# EAGLE design apresentação1 (EAGLE 6.2)
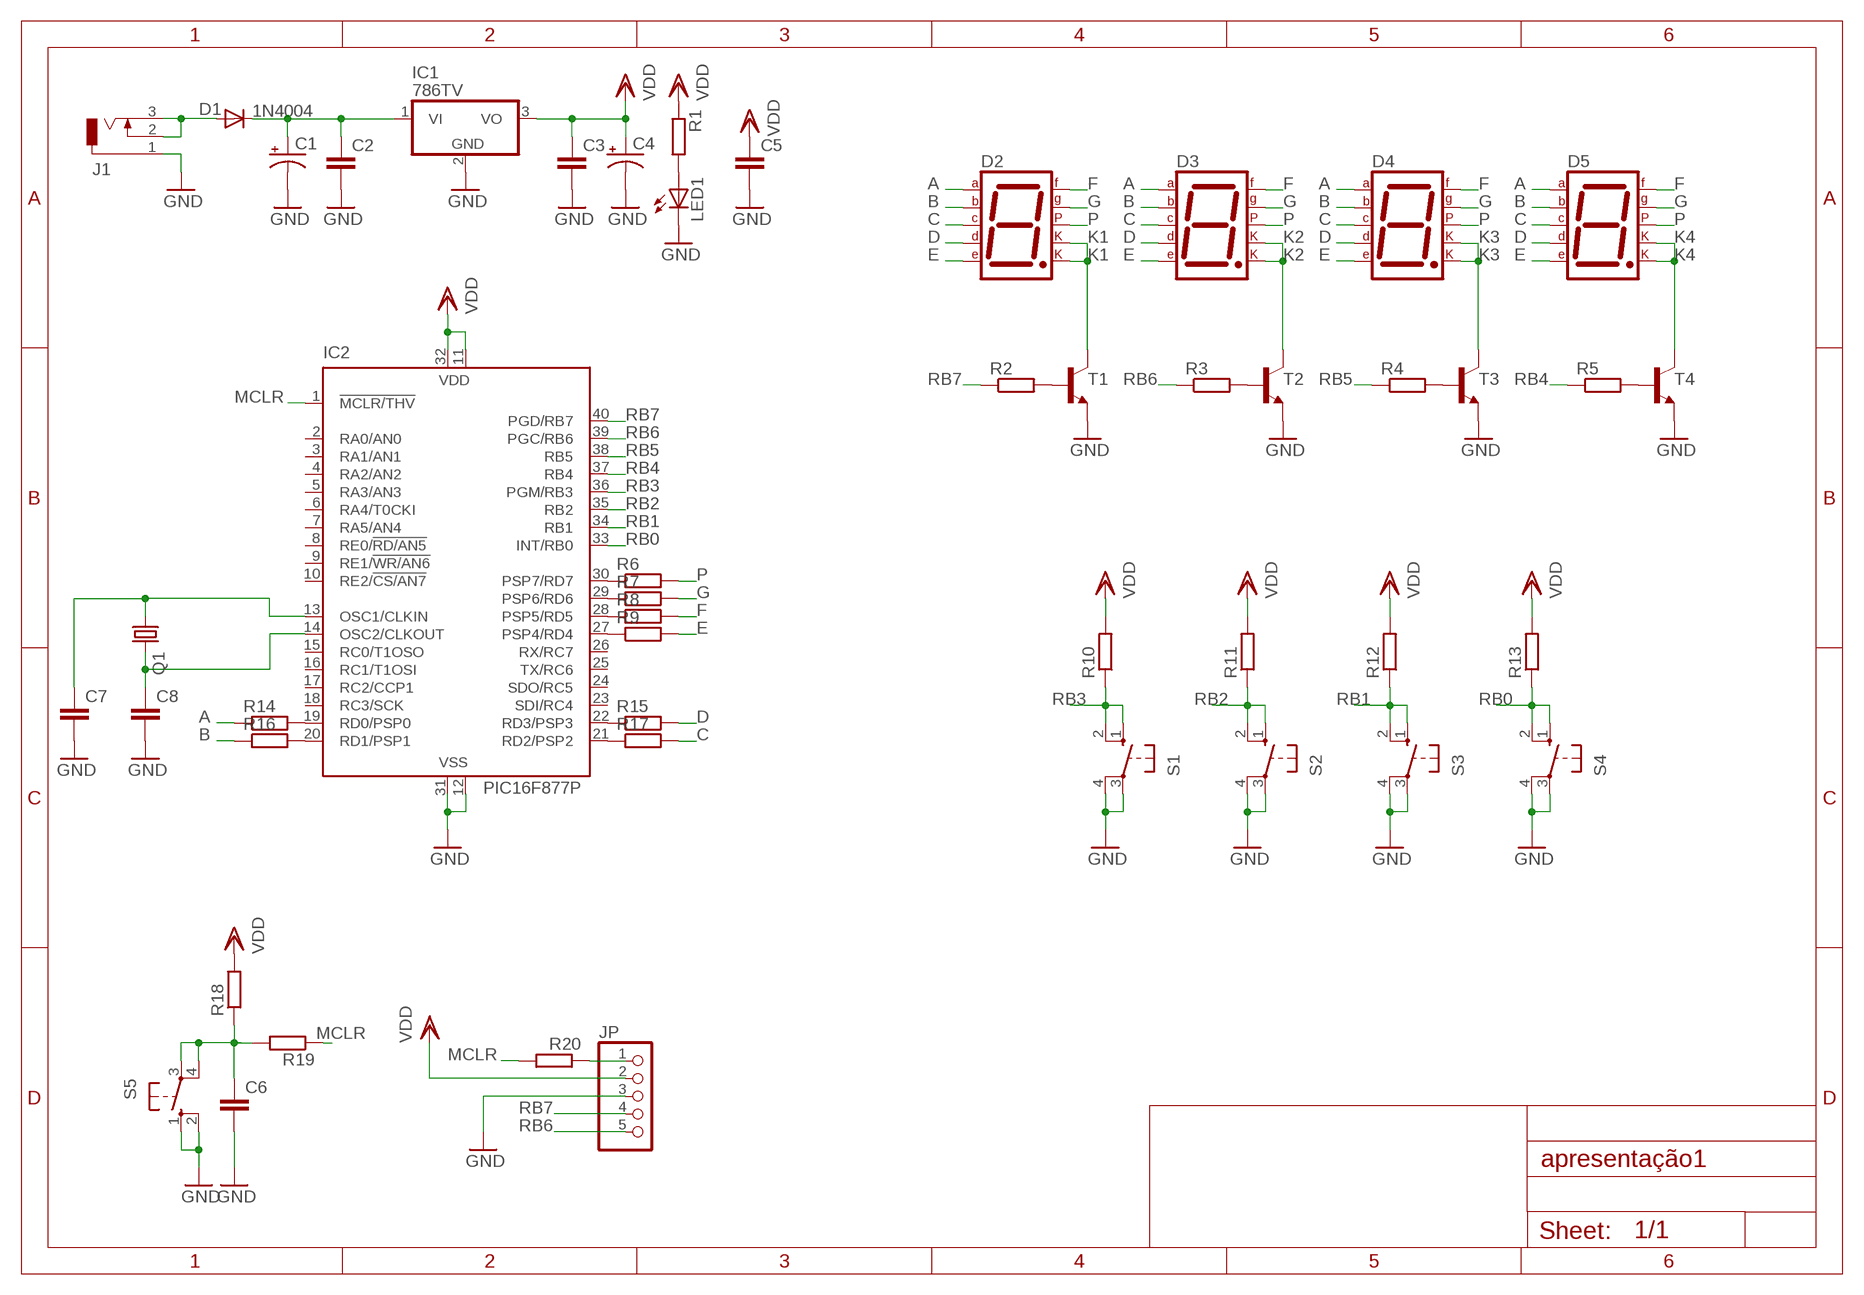
[diagram p0: schematic, sheet 1]

## Parts
C1  CPOL-USE2.5-5  [E2,5-5]
C2  C-EU025-025X050  [C025-025X050]
C3  C-EU025-025X050  [C025-025X050]
C4  CPOL-USE2.5-5  [E2,5-5]
C5  C-EU025-025X050  [C025-025X050]
C6  C-EU025-025X050  [C025-025X050]
C7  C-EU025-025X050  [C025-025X050]
C8  C-EU025-025X050  [C025-025X050]
D1  1N4004  [DO41-10]
D2  7SEG-CK  [7SEG-13]
D3  7SEG-CK  [7SEG-13]
D4  7SEG-CK  [7SEG-13]
D5  7SEG-CK  [7SEG-13]
IC1  786TV  [TO220V]
IC2  PIC16F877P  [DIL40]
J1  DCJ0303  [DCJ0303]
JP  PINHD-1X5  [1X05]
LED1  LED5MM  [LED5MM]
Q1  CRYSTALHC49S  [HC49/S]
R1  R-EU_0204/7  [0204/7]
R2  R-EU_0204/7  [0204/7]
R3  R-EU_0204/7  [0204/7]
R4  R-EU_0204/7  [0204/7]
R5  R-EU_0204/7  [0204/7]
R6  R-EU_0204/7  [0204/7]
R7  R-EU_0204/7  [0204/7]
R8  R-EU_0204/7  [0204/7]
R9  R-EU_0204/7  [0204/7]
R10  R-EU_0204/7  [0204/7]
R11  R-EU_0204/7  [0204/7]
R12  R-EU_0204/7  [0204/7]
R13  R-EU_0204/7  [0204/7]
R14  R-EU_0204/7  [0204/7]
R15  R-EU_0204/7  [0204/7]
R16  R-EU_0204/7  [0204/7]
R17  R-EU_0204/7  [0204/7]
R18  R-EU_0204/7  [0204/7]
R19  R-EU_0204/7  [0204/7]
R20  R-EU_0204/7  [0204/7]
S1  10-XX  [B3F-10XX]
S2  10-XX  [B3F-10XX]
S3  10-XX  [B3F-10XX]
S4  10-XX  [B3F-10XX]
S5  10-XX  [B3F-10XX]
T1  BC337-16-NPN-TO92-CBE  [TO92-CBE]
T2  BC337-16-NPN-TO92-CBE  [TO92-CBE]
T3  BC337-16-NPN-TO92-CBE  [TO92-CBE]
T4  BC337-16-NPN-TO92-CBE  [TO92-CBE]

## Nets
+VCC [power]: D1.A J1.2 J1.3
A [sinal]: D2.7(A) D3.7(A) D4.7(A) D5.7(A) R14.1
B [sinal]: D2.6(B) D3.6(B) D4.6(B) D5.6(B) R16.1
C [sinal]: D2.4(C) D3.4(C) D4.4(C) D5.4(C) R17.2
D [sinal]: D2.2(D) D3.2(D) D4.2(D) D5.2(D) R15.2
E [sinal]: D2.1(E) D3.1(E) D4.1(E) D5.1(E) R9.2
F [sinal]: D2.9(F) D3.9(F) D4.9(F) D5.9(F) R8.2
G [sinal]: D2.10(G) D3.10(G) D4.10(G) D5.10(G) R7.2
GND: C1.- C2.2 C3.2 C4.- C5.2 C6.2 C7.2 C8.2 IC1.2(GND) IC2.12(VSS) IC2.31(VSS) J1.1 JP.3 LED1.K(C) S1.3(P) S1.4(P1) S2.3(P) S2.4(P1) S3.3(P) S3.4(P1) S4.3(P) S4.4(P1) S5.1(S) S5.2(S1) T1.E T2.E T3.E T4.E
K1 [sinal]: D2.3(CK1) D2.8(CK2) T1.C
K2 [sinal]: D3.3(CK1) D3.8(CK2) T2.C
K3 [sinal]: D4.3(CK1) D4.8(CK2) T3.C
K4 [sinal]: D5.3(CK1) D5.8(CK2) T4.C
MCLR [sinal]: IC2.1(!MCLR/THV) R19.1 R20.2
N$1: C7.1 IC2.13(OSC1/CLKIN) Q1.1
N$2 [power]: C1.+ C2.1 D1.C IC1.1(VI)
N$3: LED1.A R1.2
N$4: R2.2 T1.B
N$5: R3.2 T2.B
N$6: R4.2 T3.B
N$7: R5.2 T4.B
N$9 [sinal]: C6.1 R18.1 R19.2 S5.3(P) S5.4(P1)
N$12: IC2.30(PSP7/RD7) R6.1
N$13: IC2.29(PSP6/RD6) R7.1
N$14: IC2.28(PSP5/RD5) R8.1
N$15: IC2.27(PSP4/RD4) R9.1
N$16: IC2.22(RD3/PSP3) R15.1
N$17: IC2.21(RD2/PSP2) R17.1
N$18: IC2.20(RD1/PSP1) R16.2
N$19: IC2.19(RD0/PSP0) R14.2
N$20: C8.1 IC2.14(OSC2/CLKOUT) Q1.2
N$26 [sinal]: JP.1 R20.1
P [sinal]: D2.5(DP) D3.5(DP) D4.5(DP) D5.5(DP) R6.2
RB0 [sinal]: IC2.33(INT/RB0) R13.1 S4.1(S) S4.2(S1)
RB1 [sinal]: IC2.34(RB1) R12.1 S3.1(S) S3.2(S1)
RB2 [sinal]: IC2.35(RB2) R11.1 S2.1(S) S2.2(S1)
RB3 [sinal]: IC2.36(PGM/RB3) R10.1 S1.1(S) S1.2(S1)
RB4 [sinal]: IC2.37(RB4) R5.1
RB5 [sinal]: IC2.38(RB5) R4.1
RB6 [sinal]: IC2.39(PGC/RB6) JP.5 R3.1
RB7 [sinal]: IC2.40(PGD/RB7) JP.4 R2.1
VDD [power]: C3.1 C4.+ C5.1 IC1.3(VO) IC2.11(VDD) IC2.32(VDD) JP.2 R1.1 R10.2 R11.2 R12.2 R13.2 R18.2
Unconnected: IC2.2(RA0/AN0) IC2.3(RA1/AN1) IC2.4(RA2/AN2) IC2.5(RA3/AN3) IC2.6(RA4/T0CKI) IC2.7(RA5/AN4) IC2.8(RE0/!RD/AN5) IC2.9(RE1/!WR/AN6) IC2.10(RE2/!CS/AN7) IC2.15(RC0/T1OSO) IC2.16(RC1/T1OSI) IC2.17(RC2/CCP1) IC2.18(RC3/SCK) IC2.23(SDI/RC4) IC2.24(SDO/RC5) IC2.25(TX/RC6) IC2.26(RX/RC7)

## Library data of the parts
C1 C4 = rcl:CPOL-US: POLARIZED CAPACITOR, American symbol
C2 C3 C5-C8 = rcl:C-EU: CAPACITOR, European symbol
D1 = diode:1N4004: DIODE general purpose rectifier, 1 A
D2-D5 = special:7SEG-CK: 7-segment DISPLAY single cathode, 13 mm
IC1 = linear:78*: Positive VOLTAGE REGULATOR Source: http://cache.national.com/ds/LM/LM78L05.pdf http://www.fairchildsemi.com/ds/LM/LM7805.pdf
IC2 = microchip:PIC16F87*: MICROCONTROLLER; MF: MICROCHIP; MPN: PIC16F877-04/P; OC_FARNELL: 9761349; OC_NEWARK: 61K3463
J1 = con-jack:DCJ0303: DC POWER JACK Source: DCJ0303.pdf; OC_FARNELL: unknown; OC_NEWARK: unknown
JP = pinhead:PINHD-1X5: PIN HEADER
LED1 = led:LED: LED OSRAM: - CHIPLED LG R971, LG N971, LY N971, LG Q971, LY Q971, LO R971, LY R971 LH N974, LH R974 LS Q976, LO Q976, LY Q976 LO Q996 - Hyper CHIPLED LW Q18S LB Q993, LB Q99A, LB R99A - SideLED LS A670, LO A670, LY A670, LG A670, LP A670 LB A673, LV A673, LT A673, LW A673 LH A674 LY A675 LS A676, LA A676, LO A676, LY A676, LW A676 LS A679, LY A679, LG A679 - Hyper Micro SIDELED® LS Y876, LA Y876, LO Y876, LY Y876 LT Y87S - SmartLED LW L88C, LW L88S LB L89C, LB L89S, LG L890 LS L89K, LO L89K, LY L89K LS L896, LA L896, LO L896, LY L896 - TOPLED LS T670, LO T670, LY T670, LG T670, LP T670 LSG T670, LSP T670, LSY T670, LOP T670, LYG T670 LG T671, LOG T671, LSG T671 LB T673, LV T673, LT T673, LW T673 LH T674 LS T676, LA T676, LO T676, LY T676, LB T676, LH T676, LSB T676, LW T676 LB T67C, LV T67C, LT T67C, LS T67K, LO T67K, LY T67K, LW E67C LS E67B, LA E67B, LO E67B, LY E67B, LB E67C, LV E67C, LT E67C LW T67C LS T679, LY T679, LG T679 LS T770, LO T770, LY T770, LG T770, LP T770 LB T773, LV T773, LT T773, LW T773 LH T774 LS E675, LA E675, LY E675, LS T675 LS T776, LA T776, LO T776, LY T776, LB T776 LHGB T686 LT T68C, LB T68C - Hyper Mini TOPLED® LB M676 - Mini TOPLED Santana® LG M470 LS M47K, LO M47K, LY M47K Source: http://www.osram.convergy.de LUXEON: - LUMILED® LXK2-PW12-R00, LXK2-PW12-S00, LXK2-PW14-U00, LXK2-PW14-V00 LXK2-PM12-R00, LXK2-PM12-S00, LXK2-PM14-U00 LXK2-PE12-Q00, LXK2-PE12-R00, LXK2-PE12-S00, LXK2-PE14-T00, LXK2-PE14-U00 LXK2-PB12-K00, LXK2-PB12-L00, LXK2-PB12-M00, LXK2-PB14-N00, LXK2-PB14-P00, LXK2-PB14-Q00 LXK2-PR12-L00, LXK2-PR12-M00, LXK2-PR14-Q00, LXK2-PR14-R00 LXK2-PD12-Q00, LXK2-PD12-R00, LXK2-PD12-S00 LXK2-PH12-R00, LXK2-PH12-S00 LXK2-PL12-P00, LXK2-PL12-Q00, LXK2-PL12-R00 Source: www.luxeon.com KINGBRIGHT: KA-3528ASYC Source: www.kingbright.com
Q1 = crystal:CRYSTAL: CRYSTAL; OC_FARNELL: 1667008; OC_NEWARK: unknown
R1-R20 = rcl:R-EU_: RESISTOR, European symbol
S1-S5 = switch-omron:10-XX: OMRON SWITCH; MPN: B3F-1000; OC_FARNELL: 176432; OC_NEWARK: 36M3542
T1-T4 = transistor:*-NPN-: NPN Transistror BF959 corrected 2008.03.06

## Net classes
1 sinal: width 0.254 mm
2 power: width 1.016 mm

## Board
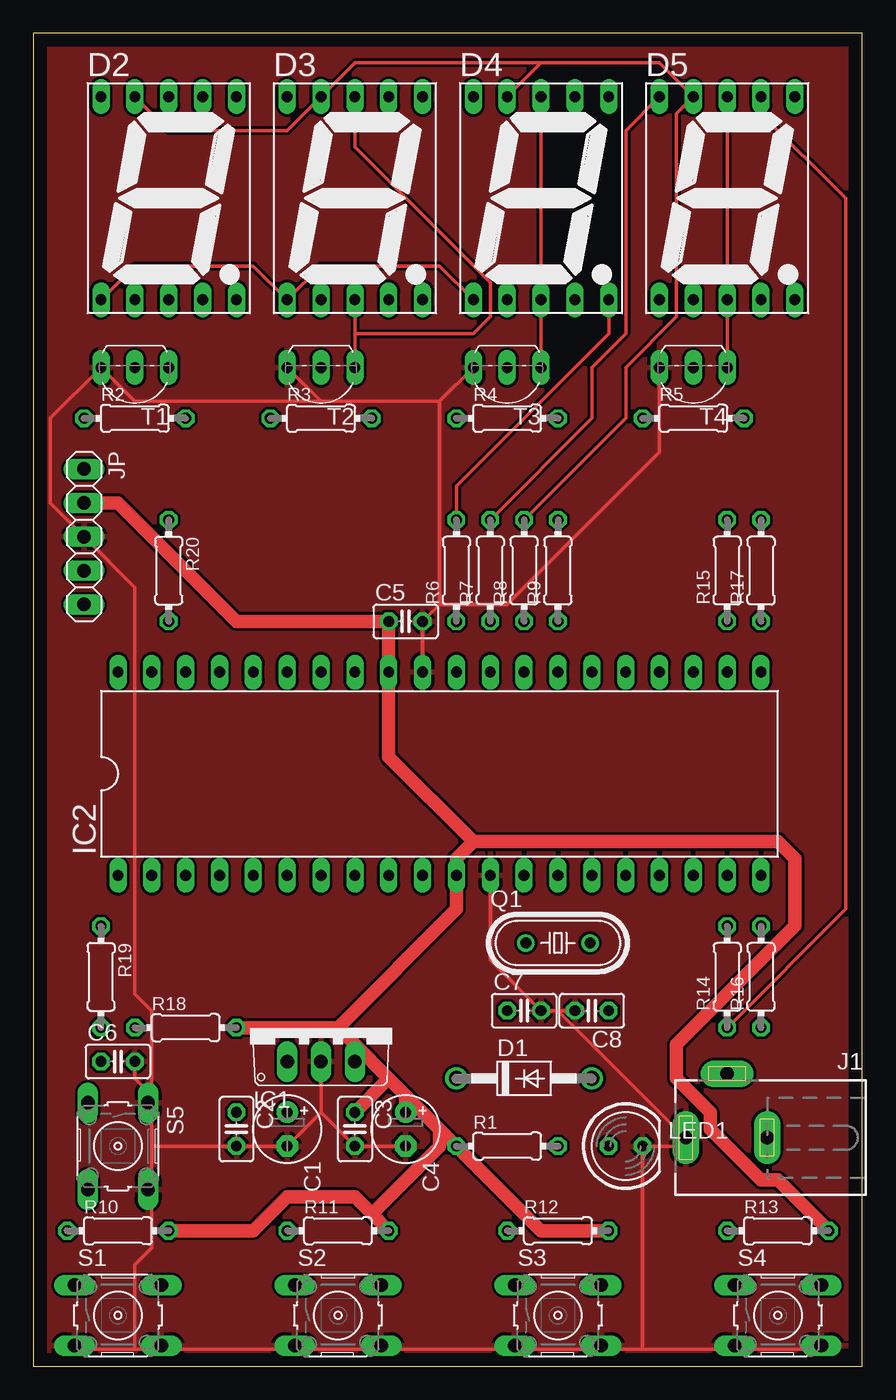
[diagram p1: board, top side]
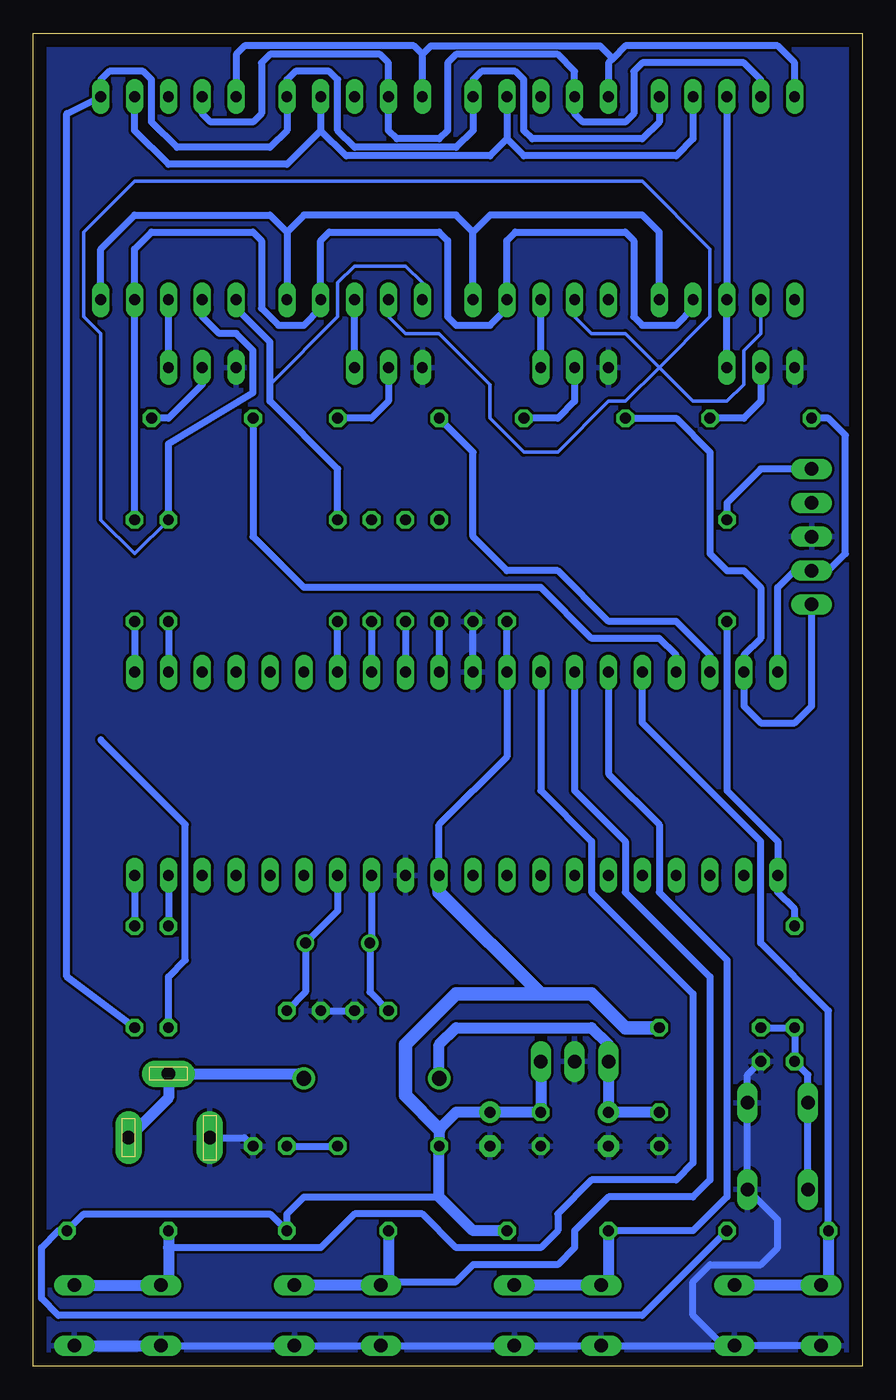
[diagram p2: board, bottom side, seen from below]

Size 62.21 x 100 mm. Coordinates in mm from the lower left corner, seen from the top.
Outline: 0,0 62.21,0 62.21,100 0,100 0,0
Copper layers (1*16): Top 0.035mm / dielectric 1.5mm / Bottom 0.035mm
Design rules: minimum track width 10mil, minimum drill 24mil, track to track 8mil, track to pad 8mil, pad to pad 8mil, via to via 8mil, smd to smd 8mil, copper to edge 40mil, drill to drill 8mil, minimum pad ring 10mil, minimum via ring 8mil, stop-mask expansion 4mil, vias tented up to drill 0mil, thermal gap 10mil

### Footprints (pad centres in the part's own frame; a part is rotated, then mirrored left to right if it is on the bottom)
E2,5-5 = drill 0.813 pad 1.6: + -1.27,0 | drill 0.813 pad 1.6 octagon: - 1.27,0
C025-025X050 = drill 0.813 octagon: 1 -1.27,0; 2 1.27,0
DO41-10 = drill 1.118: A 5.08,0; C -5.08,0
7SEG-13 = drill 0.813 long: 1 -5.08,-7.62; 2 -2.54,-7.62; 3 0,-7.62; 4 2.54,-7.62; 5 5.08,-7.62; 6 5.08,7.62; 7 2.54,7.62; 8 0,7.62; 9 -2.54,7.62; 10 -5.08,7.62
TO220V = drill 1.016 long: 1 -2.54,-2.54; 2 0,-2.54; 3 2.54,-2.54
DIL40 = drill 0.813 long: 1 -24.13,-7.62; 2 -21.59,-7.62; 3 -19.05,-7.62; 4 -16.51,-7.62; 5 -13.97,-7.62; 6 -11.43,-7.62; 7 -8.89,-7.62; 8 -6.35,-7.62; 9 -3.81,-7.62; 10 -1.27,-7.62; 11 1.27,-7.62; 12 3.81,-7.62; 13 6.35,-7.62; 14 8.89,-7.62; 15 11.43,-7.62; 16 13.97,-7.62; 17 16.51,-7.62; 18 19.05,-7.62; 19 21.59,-7.62; 20 24.13,-7.62; 21 24.13,7.62; 22 21.59,7.62; 23 19.05,7.62; 24 16.51,7.62; 25 13.97,7.62; 26 11.43,7.62; 27 8.89,7.62; 28 6.35,7.62; 29 3.81,7.62; 30 1.27,7.62; 31 -1.27,7.62; 32 -3.81,7.62; 33 -6.35,7.62; 34 -8.89,7.62; 35 -11.43,7.62; 36 -13.97,7.62; 37 -16.51,7.62; 38 -19.05,7.62; 39 -21.59,7.62; 40 -24.13,7.62
DCJ0303 = drill 1 pad 2 long: 1 0,3.1; 2 4.8,0; 3 0,-3
1X05 = drill 1.016 long: 1 -5.08,0; 2 -2.54,0; 3 0,0; 4 2.54,0; 5 5.08,0
LED5MM = drill 0.813 octagon: A -1.27,0; K 1.27,0
HC49/S = drill 0.813: 1 -2.413,0; 2 2.413,0
0204/7 = drill 0.813 octagon: 1 -3.81,0; 2 3.81,0
B3F-10XX = drill 1.016 long: 1 -3.251,2.261; 2 3.251,2.261; 3 -3.251,-2.261; 4 3.251,-2.261
TO92-CBE = drill 0.813 long: B 0,0; C -2.54,0; E 2.54,0

### Placement (x,y rotation side)
C1  19.05,17.78 270 top
C2  15.24,17.78 270 top
C3  24.13,17.78 270 top
C4  27.94,17.78 270 top
C5  27.94,55.88 0 top
C6  6.35,22.86 0 top
C7  36.83,26.67 0 top
C8  41.91,26.67 180 top
D1  36.83,21.59 0 top
D2  10.16,87.63 0 top
D3  24.13,87.63 0 top
D4  38.1,87.63 0 top
D5  52.07,87.63 0 top
IC1  21.59,25.4 0 top
IC2  30.48,44.45 0 top
J1  52.07,17.14 90 top
JP  3.81,62.23 270 top
LED1  44.45,16.51 0 top
Q1  39.37,31.75 0 top
R1  35.56,16.51 0 top
R2  7.62,71.12 0 top
R3  21.59,71.12 0 top
R4  35.56,71.12 0 top
R5  49.53,71.12 0 top
R6  31.75,59.69 90 top
R7  34.29,59.69 90 top
R8  36.83,59.69 90 top
R9  39.37,59.69 90 top
R10  6.35,10.16 0 top
R11  22.86,10.16 0 top
R12  39.37,10.16 0 top
R13  55.88,10.16 0 top
R14  52.07,29.21 90 top
R15  52.07,59.69 90 top
R16  54.61,29.21 90 top
R17  54.61,59.69 90 top
R18  11.43,25.4 0 top
R19  5.08,29.21 270 top
R20  10.16,59.69 270 top
S1  6.35,3.81 0 top
S2  22.86,3.81 0 top
S3  39.37,3.81 0 top
S4  55.88,3.81 0 top
S5  6.35,16.51 270 top
T1  7.62,74.93 180 top
T2  21.59,74.93 180 top
T3  35.56,74.93 180 top
T4  49.53,74.93 180 top

### Tracks (layer width: path | path; a pad name or v marks a point on that pad's centre or on a via)
+VCC
  Bottom 0.813: J1.3 52.07,20.14 J1.2 42.27,21.95 D1.A
A
  Top 0.254: R14.1 60.96,34.29 60.96,87.63 54.61,93.98 D5.7
  Bottom 0.508: D2.7 12.7,92.08 13.97,90.81 25.4,90.81 26.67,92.08 | D3.7 26.67,92.08 | 26.67,92.08 27.94,90.81 38.73,90.81 40.64,92.71 | D4.7 40.64,92.71 | 40.64,92.71 43.18,90.17 52.07,90.17 54.61,92.71 D5.7 | R14.1 52.07,29.21 50.8,30.48 50.8,40.64 57.15,46.99
B
  Bottom 0.508: D2.6 15.24,93.34 16.51,92.08 24.77,92.08 25.4,92.71 25.4,96.52 26.04,97.16 28.57,97.16 29.21,96.52 D3.6 29.21,92.71 30.48,91.44 38.1,91.44 39.37,92.71 39.37,96.52 40.01,97.16 42.55,97.16 43.18,96.52 D4.6 43.18,92.71 44.45,91.44 51.44,91.44 53.34,93.34 53.34,96.52 53.98,97.16 56.52,97.16 57.15,96.52 D5.6 59.69,93.98 59.69,29.21 R16.1
C
  Bottom 0.508: D2.4 12.7,79.38 13.97,78.11 16.51,78.11 17.14,78.74 17.14,84.45 17.78,85.09 26.04,85.09 26.67,84.45 D3.4 26.67,79.38 27.94,78.11 30.48,78.11 31.11,78.74 31.11,84.45 31.75,85.09 40.01,85.09 40.64,84.45 D4.4 40.64,79.38 41.91,78.11 43.81,78.11 45.09,79.38 45.09,84.45 45.72,85.09 53.34,85.09 54.61,83.82 D5.4 R17.2
D
  Bottom 0.254: D2.2 7.62,77.47 8.89,76.2 8.89,73.66 10.16,72.39 12.7,72.39 15.24,74.93 | 15.24,74.93 17.78,77.47 20.32,77.47 21.59,78.74 D3.2 | D4.2 35.56,78.74 34.29,77.47 31.75,77.47 27.94,73.66 27.94,71.12 25.4,68.58 22.86,68.58 19.05,72.39 17.78,72.39 15.24,74.93 | R15.2 54.61,60.96 57.15,63.5 57.15,77.47 58.42,78.74 58.42,85.09 54.61,88.9 16.51,88.9 11.43,83.82 11.43,78.74 15.24,74.93
  Bottom 0.508: R15.2 52.07,69.22 45.72,73.03 45.72,76.2 46.99,77.47 48.26,77.47 49.53,78.74 D5.2
E
  Top 0.254: D2.1 7.62,82.55 16.51,82.55 D3.1 21.59,82.55 30.48,82.55 D4.1
  Bottom 0.254: D4.1 33.02,81.28 34.29,82.55 38.1,82.55 39.37,81.28 39.37,78.74 44.45,73.66
  Bottom 0.508: R9.2 39.37,67.31 44.45,72.39 44.45,73.66 44.45,76.83 46.99,79.38 D5.1
F
  Top 0.254: D2.9 10.16,92.71 19.05,92.71 D3.9 24.13,97.79 38.1,97.79 | R8.2 44.45,71.12 44.45,74.93 48.26,78.74 48.26,93.98 D5.9 46.99,97.79 38.1,97.79 | 38.1,97.79 D4.9
  Bottom 0.508: D2.9 7.62,96.52 8.89,97.79 16.51,97.79 17.14,97.16 17.14,93.98 17.78,93.34 20.95,93.34 21.59,93.98 D3.9 21.59,97.16 22.86,98.42 30.48,98.42 31.11,97.79 31.11,92.71 31.75,92.08 34.92,92.08 35.56,92.71 D4.9 35.56,97.79 36.2,98.42 44.45,98.42 45.09,97.79 45.09,93.98 45.72,93.34 48.9,93.34 49.53,93.98 D5.9
G
  Top 0.254: R7.2 41.91,71.12 41.91,74.93 44.45,77.47 44.45,92.71 D5.10
  Bottom 0.508: D2.10 5.08,97.79 6.35,99.06 17.78,99.06 18.73,98.11 | 18.73,98.11 19.05,97.79 D3.10 | 33.02,98.42 32.38,99.06 19.68,99.06 18.73,98.11 | D4.10 33.02,98.42 | 33.02,98.42 33.66,99.06 46.35,99.06 46.99,98.42 D5.10
GND
  Top 0.254: 21.59,72.39 T2.E | 30.48,72.39 21.59,72.39 | T3.E 30.48,72.39 | IC2.31 C5.2 30.48,57.15 | T4.E 46.99,68.58 35.56,57.15 30.48,57.15 | 30.48,57.15 30.48,72.39 | 21.59,72.39 7.62,72.39 T1.E 1.27,71.12 1.27,64.77 JP.3 7.62,58.42 7.62,27.94 8.89,26.67 8.89,20.32 | C8.2 39.37,26.67 | 39.37,26.67 C7.2 34.29,30.48 IC2.12 | 39.37,26.67 48.26,17.78 J1.1 48.26,16.51 LED1.K 45.72,1.27 | C6.2 7.62,21.59 8.89,20.32 | 8.89,16.51 8.89,19.05 S5.1 8.89,20.32 | 8.89,16.51 8.89,13.97 S5.2 8.89,12.7 8.89,8.89 7.62,7.62 7.62,1.27 | C4.- C3.2 21.59,19.05 | 21.59,19.05 IC1.2 | 21.59,19.05 C1.- C2.2 8.89,16.51 | S4.4 58.42,1.27 53.34,1.27 S4.3 52.07,1.27 45.72,1.27 | 7.62,1.27 8.89,1.27 S1.4 10.16,1.27 19.05,1.27 S2.3 20.32,1.27 25.4,1.27 S2.4 26.67,1.27 35.56,1.27 S3.3 36.83,1.27 41.91,1.27 S3.4 43.18,1.27 45.72,1.27 | 7.62,1.27 3.81,1.27 S1.3
  Bottom 0.508: IC2.31 C5.2 | C6.2 8.61,21.87 S5.1 S5.2 6.35,11 6.35,8.89 7.62,7.62 11.43,7.62 12.7,6.35 12.7,3.81 10.44,1.55 S1.4 | S1.3 S1.4 | S4.3 S3.4 S3.3 S2.4 S2.3 S1.4 | J1.1 46.35,17.14 LED1.K | C8.2 C7.2
  Bottom 0.813: S4.4 S4.3
  pour Bottom: -1.27,100.33 63.5,100.33 63.5,0 -1.27,0
  pour Top: -1.27,100.33 62.23,100.33 62.23,0 -1.27,0
K1
  Bottom 0.508: T1.C D2.3 D2.8
K2
  Top 0.254: D3.3 24.13,77.47 | 24.13,77.47 T2.C | D3.8 24.13,91.44 34.29,81.28 34.29,78.74 33.02,77.47 24.13,77.47
  Bottom 0.508: T2.C D3.3
K3
  Top 0.254: T3.C D4.3 D4.8
  Bottom 0.508: T3.C D4.3
K4
  Top 0.254: T4.C D5.3 D5.8
  Bottom 0.508: T4.C D5.3
MCLR
  Bottom 0.508: R20.2 10.16,43.18 6.35,39.37 IC2.1 6.35,35.56 5.08,34.29 R19.1
N$1
  Bottom 0.508: IC2.13 36.83,31.88 Q1.1 36.96,28.07 C7.1
N$2
  Bottom 0.813: D1.C 31.75,24.13 30.48,25.4 20.32,25.4 19.05,24.13 IC1.1 C1.+ C2.1
N$3
  Bottom 0.508: LED1.A R1.2
N$4
  Bottom 0.508: T1.B 7.62,72.39 8.89,71.12 R2.2
N$5
  Bottom 0.508: T2.B 21.59,72.39 22.86,71.12 R3.2
N$6
  Bottom 0.508: T3.B 35.56,72.39 36.83,71.12 R4.2
N$7
  Bottom 0.508: T4.B 49.53,73.66 52.07,71.12 R5.2
N$9
  Bottom 0.508: R18.1 R19.2 C6.1 4.09,21.87 S5.3 S5.4
N$12
  Bottom 0.508: R6.1 IC2.30
N$13
  Bottom 0.508: R7.1 IC2.29
N$14
  Bottom 0.508: R8.1 IC2.28
N$15
  Bottom 0.508: IC2.27 R9.1
N$16
  Bottom 0.508: R15.1 IC2.22
N$17
  Bottom 0.508: R17.1 IC2.21
N$18
  Bottom 0.508: IC2.20 R16.2
N$19
  Bottom 0.508: IC2.19 R14.2
N$20
  Bottom 0.508: IC2.14 39.37,34.16 Q1.2 41.78,28.07 C8.1
N$26
  Bottom 0.508: JP.1 7.62,67.31 10.16,64.77 R20.1
P
  Top 0.254: R6.2 31.75,66.04 43.18,77.47 D4.5
  Bottom 0.508: D5.5 57.15,83.82 54.61,86.36 44.45,86.36 43.18,85.09 | 43.18,85.09 D4.5 | D3.5 29.21,85.09 | 29.21,85.09 30.48,86.36 41.91,86.36 43.18,85.09 | D2.5 15.24,85.09 16.51,86.36 27.94,86.36 29.21,85.09
RB0
  Bottom 0.508: IC2.33 24.13,43.18 20.32,39.37 20.32,35.56 12.7,27.94 12.7,15.24 13.97,13.97 20.32,13.97 22.86,11.43 22.86,10.16 24.13,8.89 30.48,8.89 33.02,11.43 38.1,11.43 40.64,8.89 52.07,8.89
  Bottom 0.813: S4.2 S4.1 52.07,6.63 52.07,8.89 R13.1
RB1
  Bottom 0.508: IC2.34 21.59,43.18 17.78,39.37 17.78,35.56 11.43,29.21 11.43,13.97 12.7,12.7 19.05,12.7 21.59,10.16 21.59,8.89 22.86,7.62 29.21,7.62 30.48,6.35 35.56,6.35 R12.1
  Bottom 0.813: R12.1 35.56,6.63 S3.1 S3.2
RB2
  Bottom 0.508: IC2.35 19.05,44.45 15.24,40.64 15.24,35.56 10.16,30.48 10.16,12.7 12.7,10.16 R11.1
  Bottom 0.813: R11.1 19.05,6.63 S2.1 S2.2
RB3
  Bottom 0.508: IC2.36 16.51,48.26 7.62,39.37 7.62,31.75 2.54,26.67 R10.1
  Bottom 0.813: R10.1 2.54,6.63 S1.1 S1.2
RB4
  Bottom 0.508: R5.1 45.72,62.23 41.91,58.42 24.13,58.42 20.32,54.61 15.24,54.61 13.97,53.34 IC2.37
RB5
  Bottom 0.508: IC2.38 11.43,53.34 13.97,55.88 19.05,55.88 22.86,59.69 26.67,59.69 29.21,62.23 29.21,68.58 R4.1
RB6
  Bottom 0.508: JP.5 3.81,49.53 5.08,48.26 7.62,48.26 8.89,49.53 IC2.39 8.89,53.34 7.62,54.61 7.62,58.42 8.89,59.69 10.16,59.69 11.43,60.96 11.43,68.58 13.97,71.12 R3.1
RB7
  Bottom 0.508: IC2.40 6.35,58.42 5.08,59.69 JP.4 2.54,59.69 1.27,60.96 1.27,69.85 2.54,71.12 R2.1
VDD
  Top 1.016: JP.2 6.35,64.77 15.24,55.88 C5.1 IC2.32 26.67,45.72 33.02,39.37 | R10.2 16.51,10.16 19.05,12.7 24.13,12.7 25.4,11.43 | R11.2 25.4,11.43 | 22.86,25.4 R18.2 | 30.48,17.78 R1.1 38.1,10.16 R12.2 | 30.48,17.78 27.94,20.32 | 27.94,20.32 26.67,21.59 | 26.67,21.59 24.13,24.13 | 24.13,24.13 22.86,25.4 | 26.67,21.59 C3.1 | 22.86,25.4 31.75,34.29 IC2.11 31.75,38.1 33.02,39.37 | R13.2 55.88,13.97 54.61,13.97 50.8,17.78 50.8,19.05 48.26,21.59 48.26,24.13 57.15,33.02 57.15,38.1 55.88,39.37 33.02,39.37 | 24.13,24.13 IC1.3 | 27.94,20.32 C4.+ | 25.4,11.43 30.48,16.51 30.48,17.78
  Bottom 0.508: C5.1 IC2.32 26.67,45.72 31.75,40.64 IC2.11 | 31.75,12.7 41.91,12.7 43.18,11.43 R12.2 44.45,11.43 58.42,11.43 R13.2 60.33,10.16 61.59,8.89 61.59,5.08 60.33,3.81 16.51,3.81 R10.2
  Bottom 0.813: IC1.3 C3.1 C4.+ 30.48,19.05 31.75,17.78 R1.1 31.75,12.7 29.21,10.16 R11.2
  Bottom 1.016: R18.2 17.78,25.4 20.32,27.94 24.13,27.94 | 24.13,27.94 30.48,27.94 34.29,24.13 34.29,20.32 31.75,17.78 | IC2.11 31.75,35.56 24.13,27.94